# EAGLE design 555-Sawtooth-VCO-alt (EAGLE 7.2.0)
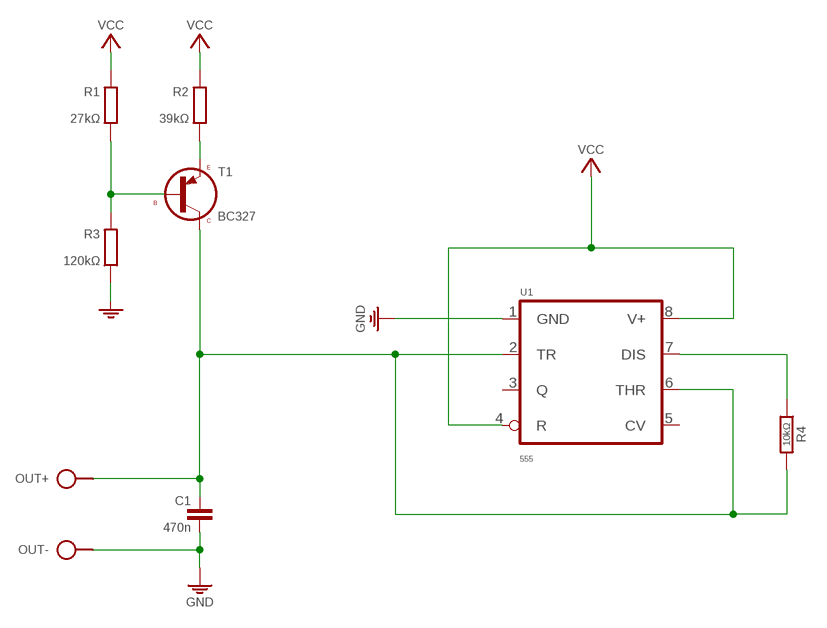
[diagram p0: schematic, sheet 1]

## Parts
C1  470n  C075-020X044/V  [C075-020X044/V]
OUT  SPAD+--+  [SPAD-+]
R1  27kΩ  R0207/10  [0207/10]
R2  39kΩ  R0207/10  [0207/10]
R3  120kΩ  R0207/10  [0207/10]
R4  10kΩ  R-H0204/10  [0204/10]
S3  VCC_GNDPWR-R  [PWR-R]
S4  VCC_GNDPWR-R  [PWR-R]
S5  VCC_GNDPWR-R  [PWR-R]
T1  BC327  [TO92]
U1  555  555_PCB555_PCB  [DIL08]

## Nets
DIS: C1.1 OUT.2 R4.2 T1.1(C) U1.2(TR) U1.6(THR)
GND: C1.2 OUT.1 R3.2 S4.1 S5.1 U1.1(GND)
N$1: R4.1 U1.7(DIS)
N$3: R2.2 T1.3(E)
N$4: R1.2 R3.1 T1.2(B)
VCC: R1.1 R2.1 S3.2 U1.4(R) U1.8(V+)
Unconnected: S3.1 S4.2 S5.2 U1.3(Q) U1.5(CV)

## Library data of the parts
C1 = c:C: CAPACITOR, European symbol
OUT = pad:SPAD+-
R1-R3 = r:R: RESISTOR, European symbol
R4 = r:R-H
S3-S5 = pad:VCC_GND
T1 = t:BC327
U1 = ic:*555_PCB

## Board
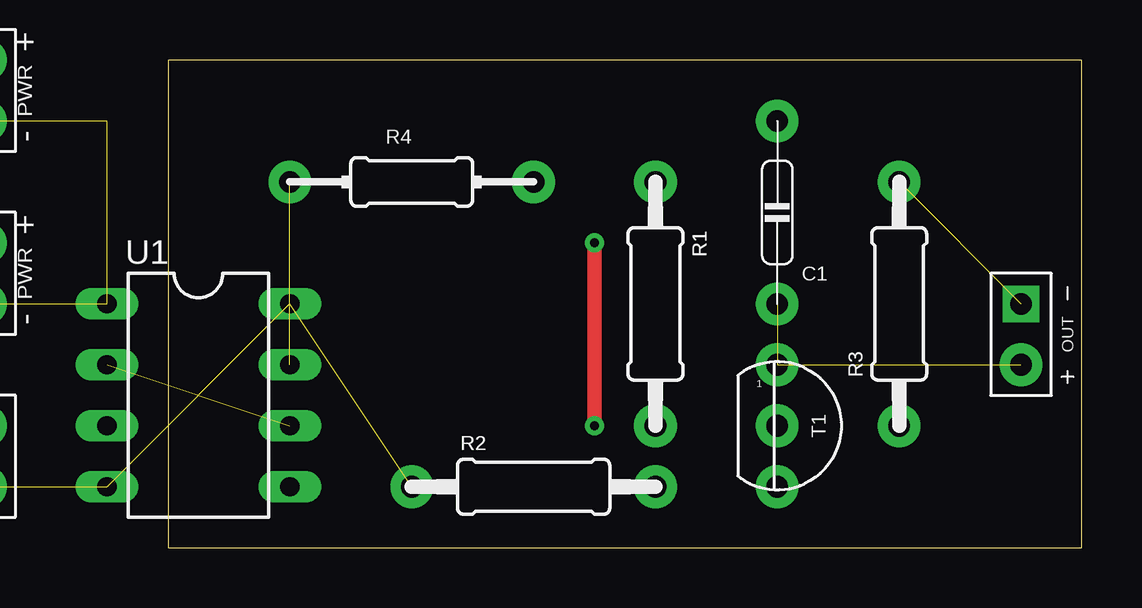
[diagram p1: board, top side]
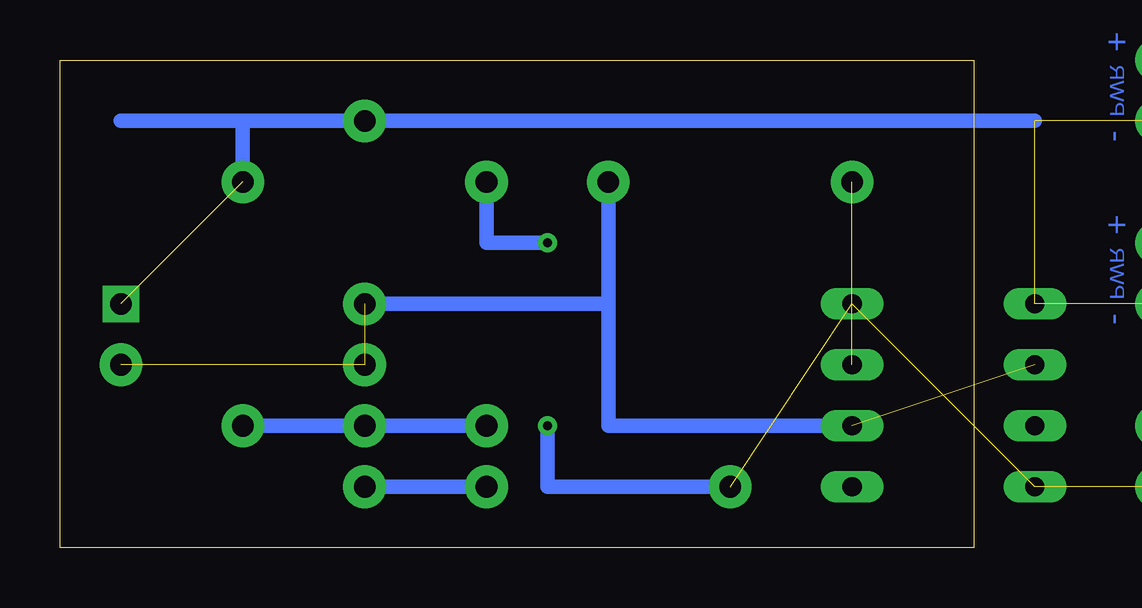
[diagram p2: board, bottom side, seen from below]

Size 38.1 x 20.32 mm. Coordinates in mm from the lower left corner, seen from the top.
Outline: 0,0 38.1,0 38.1,20.32 0,20.32 0,0
Copper layers (1*16): Top 0.035mm / dielectric 1.5mm / Bottom 0.035mm
Design rules "default": minimum track width 10mil, minimum drill 24mil, track to track 8mil, track to pad 8mil, pad to pad 8mil, via to via 8mil, smd to smd 8mil, copper to edge 40mil, drill to drill 8mil, minimum pad ring 10mil, minimum via ring 8mil, stop-mask expansion 4mil, vias tented up to drill 0mil, thermal gap 10mil

### Footprints (pad centres in the part's own frame; a part is rotated, then mirrored left to right if it is on the bottom)
C075-020X044/V = drill 0.9 pad 1.778: 1 0,3.81; 2 0,-3.81
SPAD-+ = drill 0.9 pad 1.524 square: 1 0,-1.27 | drill 0.9 pad 1.778: 2 0,1.27
0207/10 = drill 0.9 pad 1.778: 1 -5.08,0; 2 5.08,0
0204/10 = drill 0.9 pad 1.778: 1 -5.08,0; 2 5.08,0
PWR-R = drill 0.9 pad 1.778: 1 0,-1.27; 2 0,1.27
TO92 = drill 0.9 pad 1.778: 1 0,2.54; 2 0,0; 3 0,-2.54
DIL08 = drill 0.8 pad 1.27 long: 1 -3.81,3.81; 2 -3.81,1.27; 3 -3.81,-1.27; 4 -3.81,-3.81; 5 3.81,-3.81; 6 3.81,-1.27; 7 3.81,1.27; 8 3.81,3.81

### Placement (x,y rotation side)
C1  25.4,13.97 180 top
OUT  35.56,8.89 180 top
R1  20.32,10.16 270 top
R2  15.24,2.54 0 top
R3  30.48,10.16 90 top
R4  10.16,15.24 0 top
S3  -7.62,3.81 180 top  (outside the outline)
S4  -7.62,11.43 0 top  (outside the outline)
S5  -7.62,19.05 0 top  (outside the outline)
T1  25.4,5.08 0 top
U1  1.27,6.35 0 top

### Tracks (layer width: path | path; a pad name or v marks a point on that pad's centre or on a via)
DIS  (3 unrouted)
  Bottom 0.61: U1.6 15.24,5.08 15.24,10.16 | C1.1 15.24,10.16 | 15.24,10.16 R4.2
GND  (4 unrouted)
  Bottom 0.61: R3.2 30.48,17.78 | 30.48,17.78 35.56,17.78 | 30.48,17.78 C1.2 -2.54,17.78
N$1  (1 unrouted)
N$3
  Bottom 0.61: T1.3 R2.2
N$4
  Bottom 0.61: R3.1 R1.2 T1.2
VCC  (via drill 0.38)  (3 unrouted)
  Top 0.61: v17.78,12.7 v17.78,5.08
  Bottom 0.61: v17.78,12.7 20.32,12.7 R1.1 | R2.1 17.78,2.54 v17.78,5.08